# Altium schematic sheet MCU.SchDoc
size A3
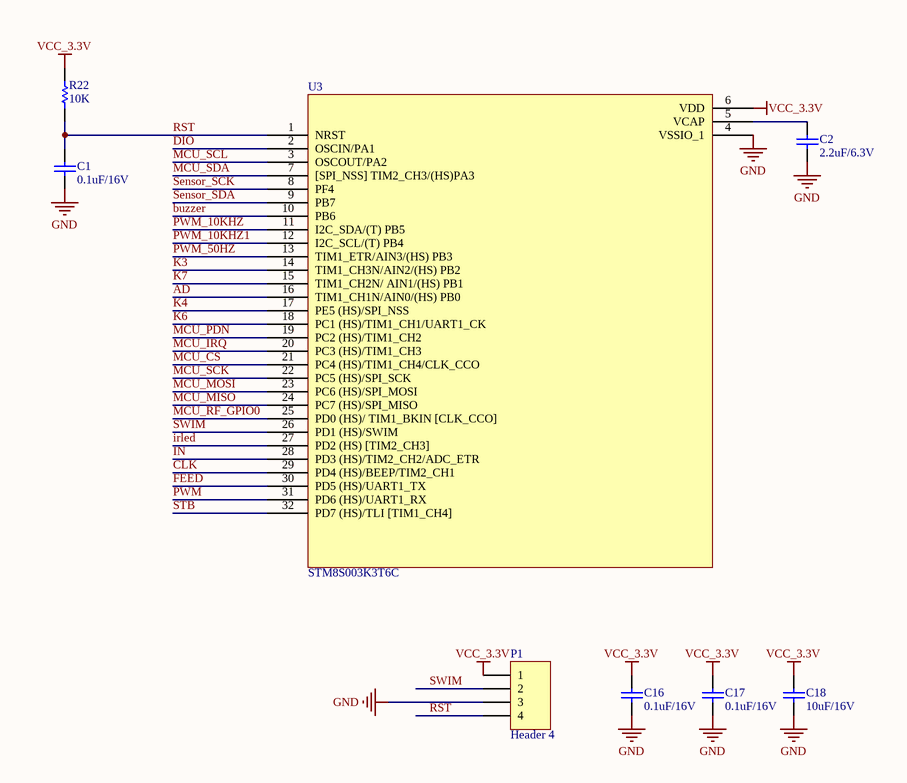
[diagram p0: MCU.SchDoc]

## Parts
C1  0.1uF/16V  [0603C]
C2  2.2uF/6.3V  [0603C]
C16  0.1uF/16V  [0603C]
C17  0.1uF/16V  [0603C]
C18  10uF/16V  [0603C]
P1  Header 4  [HDR1X4]
R22  10K  [0603R]
U3  STM8S003K3T6C  [QFP80P900X900X245-32N]

## Nets
GND: C1.2 C2.1 C16.2 C17.2 C18.2 P1.3 U3.4(VSSIO_1)
VCC_3.3V: C16.1 C17.1 C18.1 P1.1 R22.2 U3.6(VDD)
AD: U3.16(TIM1_CH1N/AIN0/(HS)_PB0)
buzzer: U3.10(PB6)
CLK: U3.29(PD4_(HS)/BEEP/TIM2_CH1)
DIO: U3.2(OSCIN/PA1)
FEED: U3.30(PD5_(HS)/UART1_TX)
IN: U3.28(PD3_(HS)/TIM2_CH2/ADC_ETR)
irled: U3.27(PD2_(HS)_[TIM2_CH3])
K3: U3.14(TIM1_CH3N/AIN2/(HS)_PB2)
K4: U3.17(PE5_(HS)/SPI_NSS)
K6: U3.18(PC1_(HS)/TIM1_CH1/UART1_CK)
K7: U3.15(TIM1_CH2N/_AIN1/(HS)_PB1)
MCU_CS: U3.21(PC4_(HS)/TIM1_CH4/CLK_CCO)
MCU_IRQ: U3.20(PC3_(HS)/TIM1_CH3)
MCU_MISO: U3.24(PC7_(HS)/SPI_MISO)
MCU_MOSI: U3.23(PC6_(HS)/SPI_MOSI)
MCU_PDN: U3.19(PC2_(HS)/TIM1_CH2)
MCU_RF_GPIO0: U3.25(PD0_(HS)/_TIM1_BKIN_[CLK_CCO])
MCU_SCK: U3.22(PC5_(HS)/SPI_SCK)
MCU_SCL: U3.3(OSCOUT/PA2)
MCU_SDA: U3.7([SPI_NSS]_TIM2_CH3/(HS)PA3)
PWM: U3.31(PD6_(HS)/UART1_RX)
PWM_10KHZ: U3.11(I2C_SDA/(T)_PB5)
PWM_10KHZ1: U3.12(I2C_SCL/(T)_PB4)
PWM_50HZ: U3.13(TIM1_ETR/AIN3/(HS)_PB3)
RST: C1.1 P1.4 R22.1 U3.1(NRST)
Sensor_SCK: U3.8(PF4)
Sensor_SDA: U3.9(PB7)
STB: U3.32(PD7_(HS)/TLI_[TIM1_CH4])
SWIM: P1.2 U3.26(PD1_(HS)/SWIM)
NetC2_2: C2.2 U3.5(VCAP)

## Library data of the parts
C1 C16-C18 = Cap: Capacitor; Value: 2.2uF/6.3V; Published: 8-Jun-2000; LatestRevisionDate: 17-Jul-2002; LatestRevisionNote: Re-released for DXP Platform.; PackageReference: RAD-0.3; Publisher: Altium Limited
C2 = Cap: Capacitor; Published: 8-Jun-2000; LatestRevisionDate: 17-Jul-2002; LatestRevisionNote: Re-released for DXP Platform.; PackageReference: RAD-0.3; Publisher: Altium Limited; Value: 2.2uF/6.3V
P1 = Header 4: Header, 4-Pin; LatestRevisionDate: 17-Jul-2002; LatestRevisionNote: Re-released for DXP Platform.; Publisher: Altium Limited
R22 = Res1: Resistor; Value: 1K; Published: 8-Jun-2000; LatestRevisionDate: 17-Jul-2002; LatestRevisionNote: Re-released for DXP Platform.; PackageReference: AXIAL-0.3; Publisher: Altium Limited